# EAGLE design rfid-access-control (EAGLE 7.5.0)
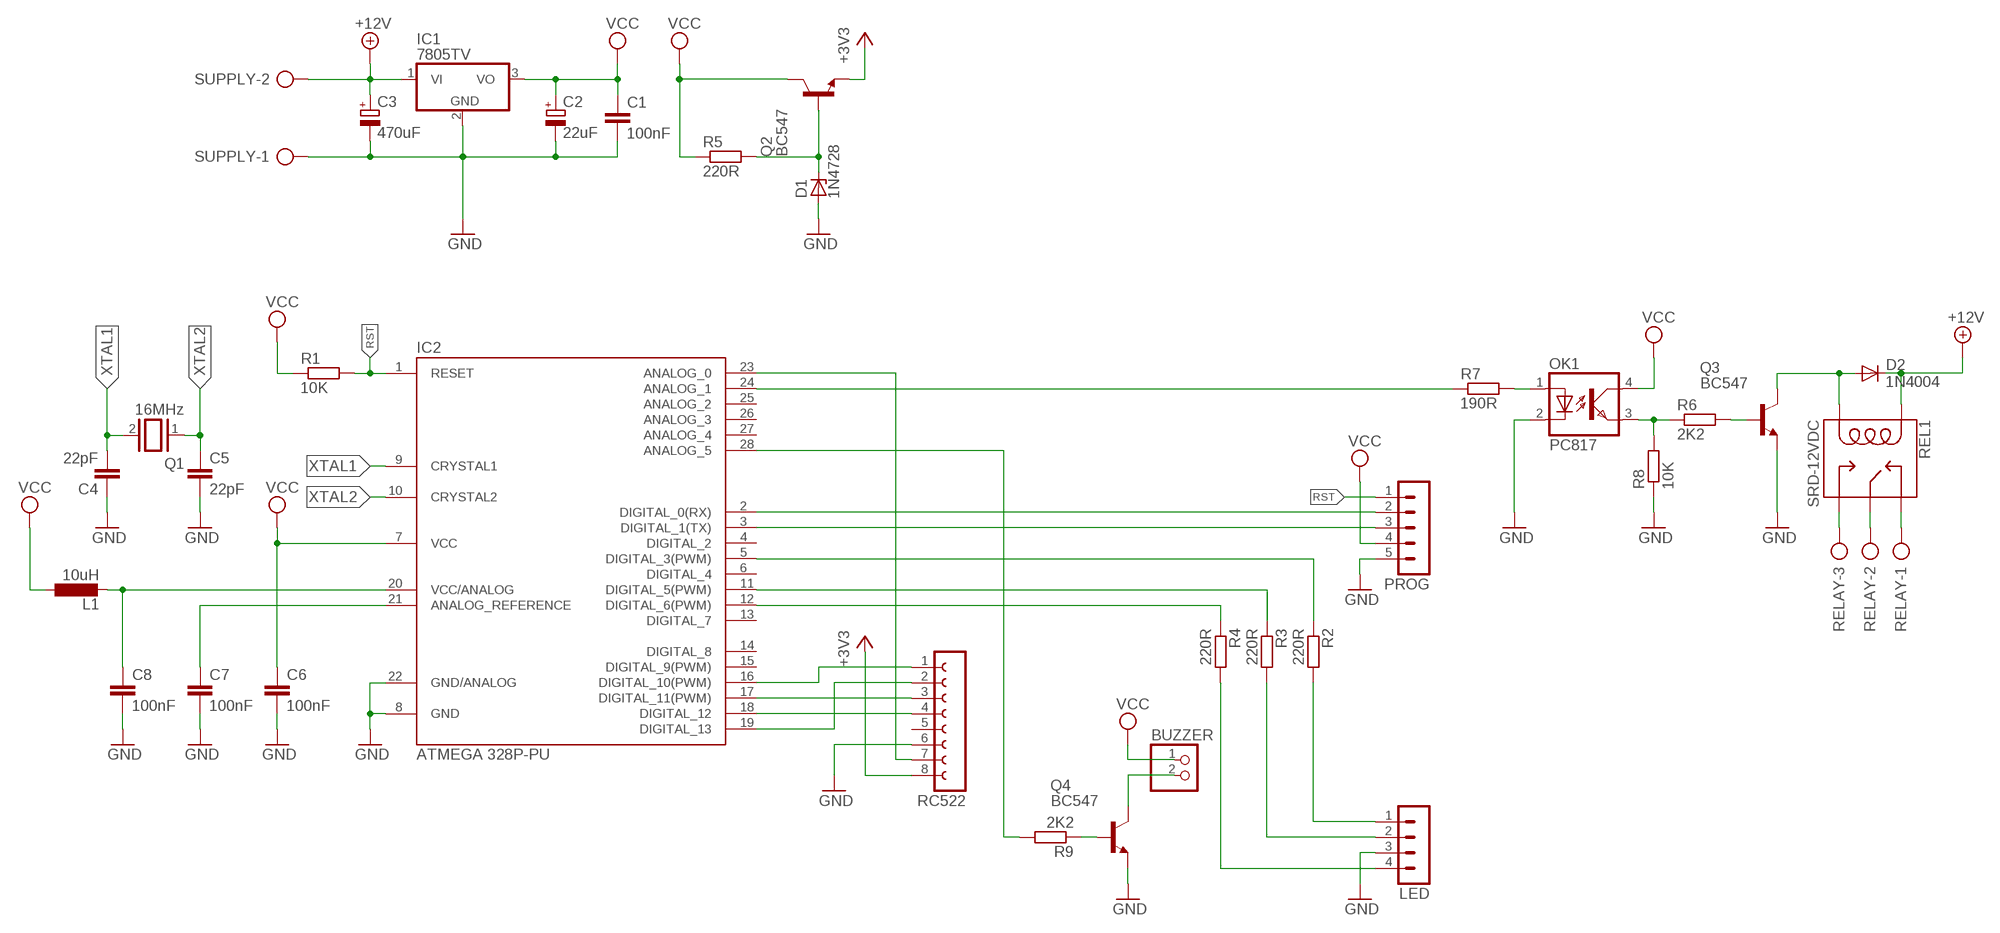
[diagram p0: schematic, sheet 1]

## Parts
BUZZER  PINHD-1X2  [1X02]
C1  100nF  C-EU025-025X050  [C025-025X050]
C2  22uF  CPOL-EUE2.5-7  [E2,5-7]
C3  470uF  CPOL-EUE2.5-7  [E2,5-7]
C4  22pF  C-EU025-025X050  [C025-025X050]
C5  22pF  C-EU025-025X050  [C025-025X050]
C6  100nF  C-EU025-025X050  [C025-025X050]
C7  100nF  C-EU025-025X050  [C025-025X050]
C8  100nF  C-EU025-025X050  [C025-025X050]
D1  1N4728  [DO41Z10]
D2  1N4004  [DO41-10]
IC1  7805TV  [TO220V]
IC2  ATMEGA 328P-PU  ATMEGA168-PU  [DIL28-3]
L1  10uH  L-EU0207/7  [0207/7]
LED  MA04-1  [MA04-1]
OK1  PC817  [DIL04]
PROG  MA05-1  [MA05-1]
Q1  16MHz  XTAL/S  [QS]
Q2  BC547  [TO92]
Q3  BC547  [TO92]
Q4  BC547  [TO92]
R1  10K  R-EU_0207/7  [0207/7]
R2  220R  R-EU_0207/7  [0207/7]
R3  220R  R-EU_0207/7  [0207/7]
R4  220R  R-EU_0207/7  [0207/7]
R5  220R  R-EU_0207/7  [0207/7]
R6  2K2  R-EU_0207/7  [0207/7]
R7  190R  R-EU_0207/7  [0207/7]
R8  10K  R-EU_0207/7  [0207/7]
R9  2K2  R-EU_0207/7  [0207/7]
RC522  FE08-1  [FE08]
REL1  SRD-12VDC  RELAYPTH  [SRD-05VDC-SL-C]
RELAY  AK500/3  [AK500/3]
SUPPLY  AK500/2  [AK500/2]

## Nets
+3V3: Q2.1(E) RC522.8
+12V: C3.+ D2.C IC1.1(VI) REL1.COIL1 SUPPLY.2
GND: C1.2 C2.- C3.- C4.1 C5.2 C6.2 C7.2 C8.2 D1.A IC1.2(GND) IC2.8(GND) IC2.22(GND/ANALOG) LED.3 OK1.2(C) PROG.5 Q3.1(E) Q4.1(E) R8.1 RC522.6 SUPPLY.1
N$1: IC2.16(DIGITAL_10(PWM)) RC522.1
N$2: C8.1 IC2.20(VCC/ANALOG) L1.2
N$3: C7.1 IC2.21(ANALOG_REFERENCE)
N$4: IC2.19(DIGITAL_13) RC522.2
N$5: IC2.17(DIGITAL_11(PWM)) RC522.3
N$6: IC2.18(DIGITAL_12) RC522.4
N$7: IC2.23(ANALOG_0) RC522.7
N$8: LED.2 R3.2
N$9: LED.1 R2.2
N$10: LED.4 R4.2
N$11: IC2.5(DIGITAL_3(PWM)) R2.1
N$12: IC2.11(DIGITAL_5(PWM)) R3.1
N$13: IC2.12(DIGITAL_6(PWM)) R4.1
N$14: IC2.28(ANALOG_5) R9.2
N$15: D1.C Q2.2(B) R5.2
N$16: REL1.SWCLOSED(SWCLOSE) RELAY.1
N$17: D2.A Q3.3(C) REL1.COIL0
N$18: REL1.SWCOMMON RELAY.2
N$19: IC2.3(DIGITAL_1(TX)) PROG.3
N$20: IC2.2(DIGITAL_0(RX)) PROG.2
N$21: REL1.SWOPEN RELAY.3
N$22: Q3.2(B) R6.2
N$23: OK1.3(EMIT) R6.1 R8.2
N$24: OK1.1(A) R7.2
N$25: IC2.24(ANALOG_1) R7.1
N$26: Q4.2(B) R9.1
N$27: BUZZER.2 Q4.3(C)
RST: IC2.1(RESET) PROG.1 R1.2
VCC: BUZZER.1 C1.1 C2.+ C6.1 IC1.3(VO) IC2.7(VCC) L1.1 OK1.4(COL) PROG.4 Q2.3(C) R1.1 R5.1
XTAL1: C4.2 IC2.9(CRYSTAL1) Q1.2
XTAL2: C5.1 IC2.10(CRYSTAL2) Q1.1
Unconnected: IC2.4(DIGITAL_2) IC2.6(DIGITAL_4) IC2.13(DIGITAL_7) IC2.14(DIGITAL_8) IC2.15(DIGITAL_9(PWM)) IC2.25(ANALOG_2) IC2.26(ANALOG_3) IC2.27(ANALOG_4) RC522.5

## Library data of the parts
BUZZER = pinhead:PINHD-1X2: PIN HEADER
C1 C4-C8 = rcl:C-EU: CAPACITOR, European symbol
C2 C3 = rcl:CPOL-EU: POLARIZED CAPACITOR, European symbol
D1 = diode:1N4728: Z DIODE 3.3 V, 1W, 5 percent
D2 = diode:1N4004: DIODE general purpose rectifier, 1 A
IC1 = linear:78*: Positive VOLTAGE REGULATOR Source: http://cache.national.com/ds/LM/LM78L05.pdf http://www.fairchildsemi.com/ds/LM/LM7805.pdf
IC2 = libsArduino-AVR:ATMEGA168-PU
L1 = rcl:L-EU: INDUCTOR, European symbol
LED = con-lstb:MA04-1: PIN HEADER; OC_FARNELL: unknown; OC_NEWARK: unknown
OK1 = optocoupler:PC817: SHARP OPTO COUPLER; MPN: PC817X4J000F; OC_FARNELL: 9707727; OC_NEWARK: 97K7059
PROG = con-lstb:MA05-1: PIN HEADER; OC_FARNELL: unknown; OC_NEWARK: unknown
Q1 = special:XTAL/S: CRYSTAL
Q2-Q4 = transistor-npn:BC547*: NPN Transistor
R1-R9 = rcl:R-EU_: RESISTOR, European symbol
RC522 = con-lsta:FE08-1: FEMALE HEADER; OC_FARNELL: unknown; OC_NEWARK: unknown
REL1 = SRD-05VDC-SL-C:RELAY: SPDT relay (COM-00101)
RELAY = con-ptr500:AK500/3: CONNECTOR; OC_FARNELL: unknown; OC_NEWARK: unknown
SUPPLY = con-ptr500:AK500/2: CONNECTOR; OC_FARNELL: unknown; OC_NEWARK: unknown

## Board
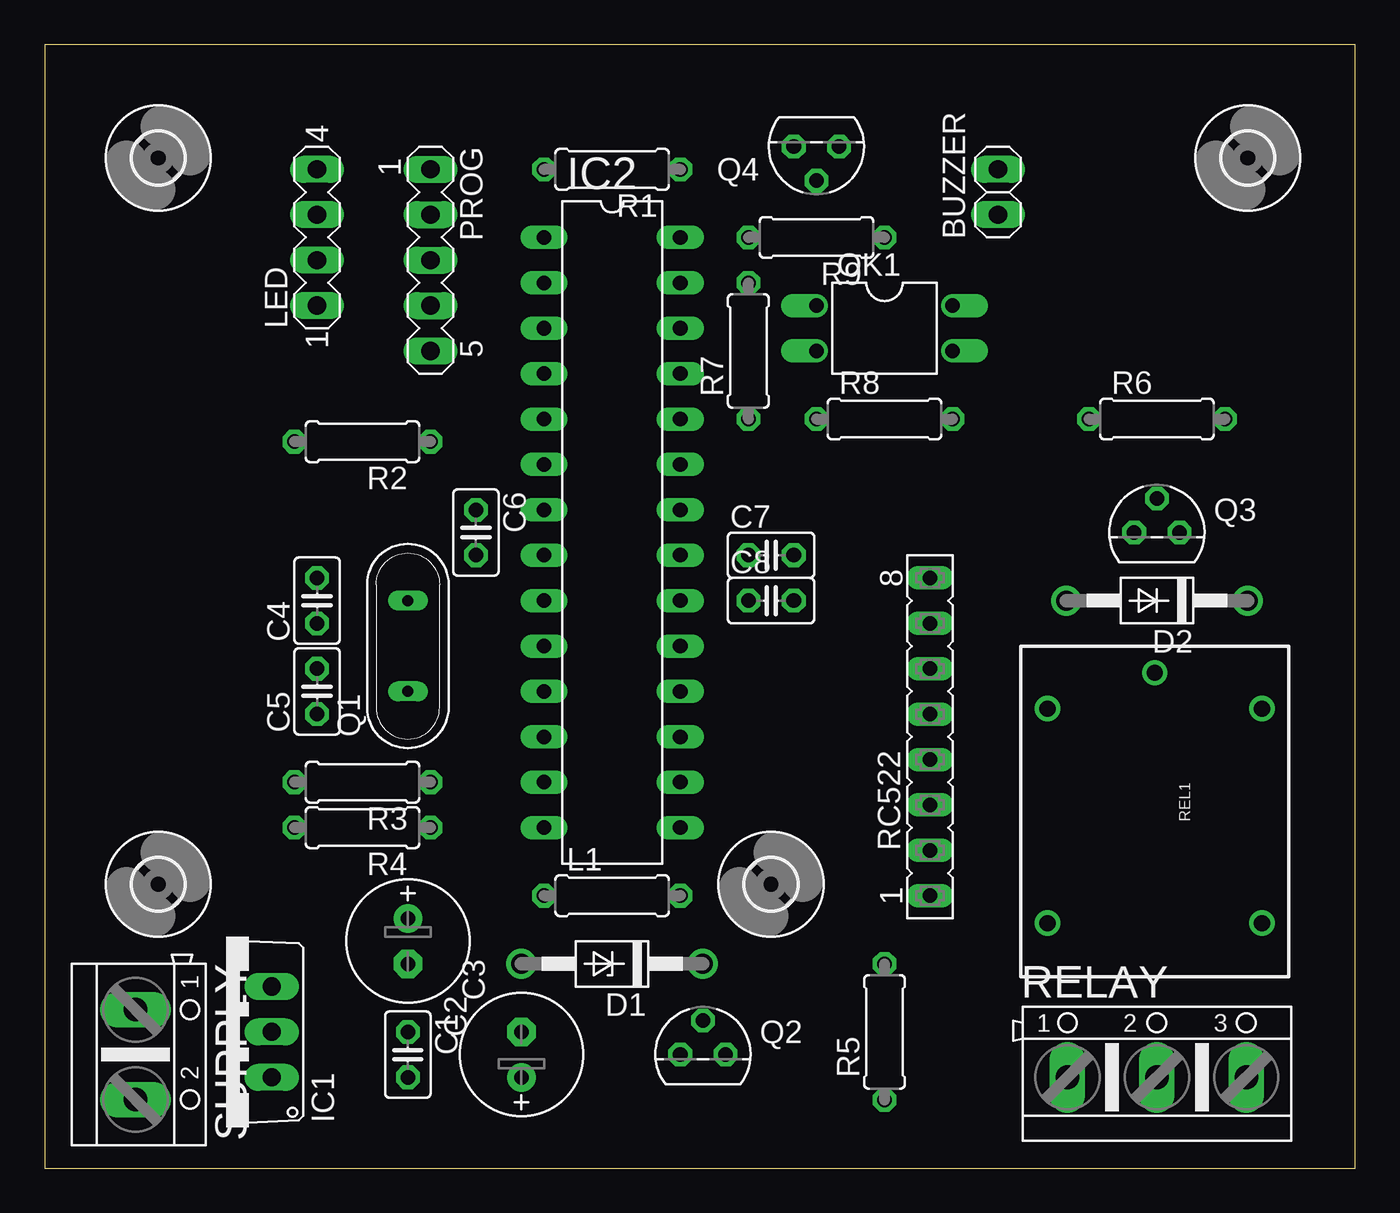
[diagram p1: board, top side]
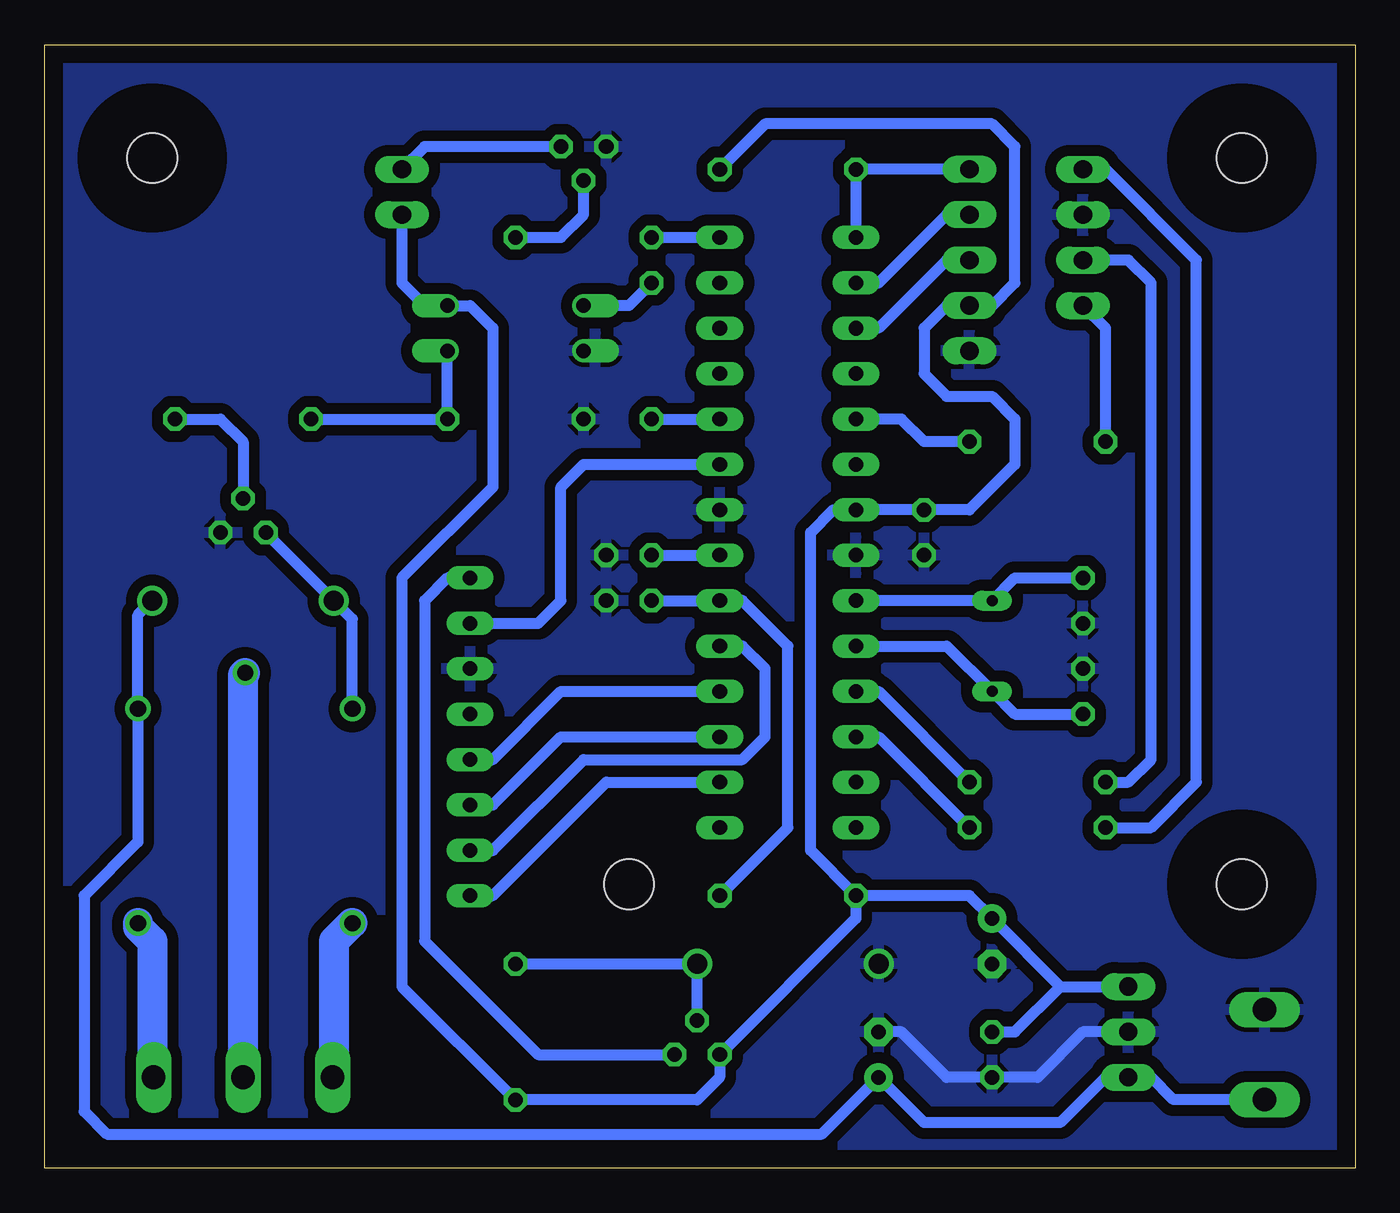
[diagram p2: board, bottom side, seen from below]

Size 73.33 x 62.85 mm. Coordinates in mm from the lower left corner, seen from the top.
Outline: 0,0 73.33,0 73.33,62.85 0,62.85 0,0
Copper layers (1*16): Top 0.035mm / dielectric 1.5mm / Bottom 0.035mm
Design rules "default": minimum track width 10mil, minimum drill 24mil, track to track 8mil, track to pad 8mil, pad to pad 8mil, via to via 8mil, smd to smd 8mil, copper to edge 40mil, drill to drill 8mil, minimum pad ring 10mil, minimum via ring 8mil, stop-mask expansion 4mil, vias tented up to drill 0mil, thermal gap 10mil

### Footprints (pad centres in the part's own frame; a part is rotated, then mirrored left to right if it is on the bottom)
1X02 = drill 1.016 long: 1 -1.27,0; 2 1.27,0
C025-025X050 = drill 0.813 octagon: 1 -1.27,0; 2 1.27,0
E2,5-7 = drill 0.813 pad 1.6: + -1.27,0 | drill 0.813 pad 1.6 octagon: - 1.27,0
DO41Z10 = drill 1.118: A 5.08,0; C -5.08,0
DO41-10 = drill 1.118: A 5.08,0; C -5.08,0
TO220V = drill 1.016 long: 1 -2.54,-2.54; 2 0,-2.54; 3 2.54,-2.54
DIL28-3 = drill 0.813 long: 1 -16.51,-3.81; 2 -13.97,-3.81; 3 -11.43,-3.81; 4 -8.89,-3.81; 5 -6.35,-3.81; 6 -3.81,-3.81; 7 -1.27,-3.81; 8 1.27,-3.81; 9 3.81,-3.81; 10 6.35,-3.81; 11 8.89,-3.81; 12 11.43,-3.81; 13 13.97,-3.81; 14 16.51,-3.81; 15 16.51,3.81; 16 13.97,3.81; 17 11.43,3.81; 18 8.89,3.81; 19 6.35,3.81; 20 3.81,3.81; 21 1.27,3.81; 22 -1.27,3.81; 23 -3.81,3.81; 24 -6.35,3.81; 25 -8.89,3.81; 26 -11.43,3.81; 27 -13.97,3.81; 28 -16.51,3.81
0207/7 = drill 0.813 octagon: 1 -3.81,0; 2 3.81,0
MA04-1 = drill 1.016 long: 1 -3.81,0; 2 -1.27,0; 3 1.27,0; 4 3.81,0
DIL04 = drill 0.813 offset: 1 -1.27,-3.81; 2 1.27,-3.81; 3 1.27,3.81; 4 -1.27,3.81
MA05-1 = drill 1.016 long: 1 -5.08,0; 2 -2.54,0; 3 0,0; 4 2.54,0; 5 5.08,0
QS = drill 0.61 long: 1 -2.54,0; 2 2.54,0
TO92 = drill 0.813 octagon: 1 1.27,0; 2 0,1.905; 3 -1.27,0
FE08 = drill 0.813 long: 1 -8.89,0; 2 -6.35,0; 3 -3.81,0; 4 -1.27,0; 5 1.27,0; 6 3.81,0; 7 6.35,0; 8 8.89,0
SRD-05VDC-SL-C = drill 0.9: COIL0 -5.39,-6.12; COIL1 -5.39,5.88; SWCLOSED 6.61,-6.12; SWCOMMON -7.39,-0.12; SWOPEN 6.61,5.88
AK500/3 = drill 1.321 long: 1 -5.004,0; 2 0,0; 3 5.004,0
AK500/2 = drill 1.321 long: 1 -2.515,0; 2 2.515,0
2,8 = hole 2.8: 0,0

### Placement (x,y rotation side)
BUZZER  53.34,54.61 90 top
C1  20.32,6.35 270 top
C2  20.32,12.7 270 top
C3  26.67,6.35 90 top
C4  15.24,31.75 90 top
C5  15.24,26.67 90 top
C6  24.13,35.56 270 top
C7  40.64,34.29 0 top
C8  40.64,31.75 0 top
D1  31.75,11.43 180 top
D2  62.23,31.75 180 top
IC1  10.16,7.62 90 top
IC2  31.75,35.56 270 top
L1  31.75,15.24 0 top
LED  15.24,52.07 90 top
OK1  46.99,46.99 270 top
PROG  21.59,50.8 270 top
Q1  20.32,29.21 90 top
Q2  36.83,6.35 0 top
Q3  62.23,35.56 0 top
Q4  43.18,57.15 180 top
R1  31.75,55.88 180 top
R2  17.78,40.64 180 top
R3  17.78,21.59 180 top
R4  17.78,19.05 180 top
R5  46.99,7.62 90 top
R6  62.23,41.91 0 top
R7  39.37,45.72 90 top
R8  46.99,41.91 0 top
R9  43.18,52.07 180 top
RC522  49.53,24.13 90 top
REL1  62.23,20.32 270 top
RELAY  62.23,5.08 0 top
SUPPLY  5.08,6.35 270 top
U$1  [2,8]  6.35,56.52 0 top
U$2  [2,8]  67.31,56.52 0 top
U$3  [2,8]  40.64,15.88 0 top
U$4  [2,8]  6.35,15.88 0 top

### Tracks (layer width: path | path; a pad name or v marks a point on that pad's centre or on a via)
+3V3
  Bottom 0.61: RC522.8 50.8,33.02 52.07,31.75 52.07,12.7 45.72,6.35 Q2.1
+12V
  Bottom 0.61: IC1.1 13.97,5.08 16.51,2.54 24.13,2.54 C3.+ 29.84,1.91 69.85,1.91 71.12,3.17 71.12,15.24 68.11,18.25 REL1.COIL1 68.11,30.95 D2.C | 12.68,5.11 IC1.1 | SUPPLY.2 10.19,3.83 11.43,5.08 IC1.1
GND
  Bottom 0.61: IC1.2 15.24,7.62 17.78,5.08 C1.2 22.86,5.08 25.4,7.62 C3.-
  pour Bottom (isolate 0.61): 0,62.87 73.03,62.87 73.03,0 0,0
N$1
  Bottom 0.61: RC522.1 48.26,15.24 41.91,21.59 IC2.16
N$2
  Bottom 0.61: L1.2 31.75,19.05 31.75,29.21 34.29,31.75 IC2.20 C8.1
N$3
  Bottom 0.61: C7.1 IC2.21
N$4
  Bottom 0.61: RC522.2 48.26,17.78 43.18,22.86 34.29,22.86 33.02,24.13 33.02,27.94 34.29,29.21 IC2.19
N$5
  Bottom 0.61: RC522.3 48.26,20.32 44.45,24.13 IC2.17
N$6
  Bottom 0.61: RC522.4 48.26,22.86 44.45,26.67 IC2.18
N$7
  Bottom 0.61: RC522.7 45.72,30.48 44.45,31.75 44.45,38.1 43.18,39.37 IC2.23
N$8
  Bottom 0.61: R3.2 12.7,21.59 11.43,22.86 11.43,49.53 12.7,50.8 LED.2
N$9
  Bottom 0.61: R2.2 13.97,46.99 LED.1
N$10
  Bottom 0.61: R4.2 11.43,19.05 8.89,21.59 8.89,50.8 13.97,55.88 LED.4
N$11
  Bottom 0.61: R2.1 24.13,40.64 25.4,41.91 IC2.5
N$12
  Bottom 0.61: IC2.11 26.67,26.67 R3.1
N$13
  Bottom 0.61: IC2.12 26.67,24.13 R4.1
N$14
  Bottom 0.61: R9.2 IC2.28
N$15
  Bottom 0.61: Q2.2 D1.C R5.2
N$16
  Bottom 1.676: REL1.SWCLOSED 56.14,13.71 57.15,12.7 57.15,5.16 RELAY.1
N$17
  Bottom 0.61: REL1.COIL0 56.11,30.71 D2.A Q3.3
N$18
  Bottom 1.676: RELAY.2 62.23,27.59 REL1.SWCOMMON
N$19
  Bottom 0.61: PROG.3 22.86,50.8 26.67,46.99 IC2.3
N$20
  Bottom 0.61: PROG.2 22.86,53.34 26.67,49.53 IC2.2
N$21
  Bottom 1.676: REL1.SWOPEN 68.11,13.5 67.31,12.7 67.31,5.16 RELAY.3
N$22
  Bottom 0.61: R6.2 63.5,41.91 62.23,40.64 Q3.2
N$23
  Bottom 0.61: OK1.3 R8.2 R6.1
N$24
  Bottom 0.61: R7.2 40.64,48.26 OK1.1
N$25
  Bottom 0.61: R7.1 IC2.24
N$26
  Bottom 0.61: R9.1 44.45,52.07 43.18,53.34 Q4.2
N$27
  Bottom 0.61: Q4.3 52.07,57.15 BUZZER.2
RST
  Bottom 0.61: PROG.1 R1.2 IC2.1
VCC
  Bottom 0.61: R1.1 33.02,58.42 20.32,58.42 19.05,57.15 19.05,49.53 20.32,48.26 PROG.4 22.86,48.26 24.13,46.99 24.13,44.45 22.86,43.18 20.32,43.18 19.05,41.91 19.05,39.37 21.59,36.83 C6.1 IC2.7 29.21,36.83 30.48,35.56 30.48,17.78 L1.1 | C1.1 19.05,7.62 16.51,10.16 | 16.51,10.16 IC1.3 | 16.51,10.16 C2.+ 21.59,15.24 L1.1 | L1.1 27.94,13.97 Q2.3 35.56,5.08 36.83,3.81 R5.1 53.34,10.16 53.34,33.02 48.26,38.1 48.26,46.99 49.53,48.26 OK1.4 52.07,48.26 53.34,49.53 BUZZER.1
XTAL1
  Bottom 0.61: IC2.9 Q1.2 19.05,33.02 C4.2
XTAL2
  Bottom 0.61: IC2.10 22.86,29.21 Q1.1 19.05,25.4 C5.1